# EAGLE design CPLD_Adapter (EAGLE 9.3.1)
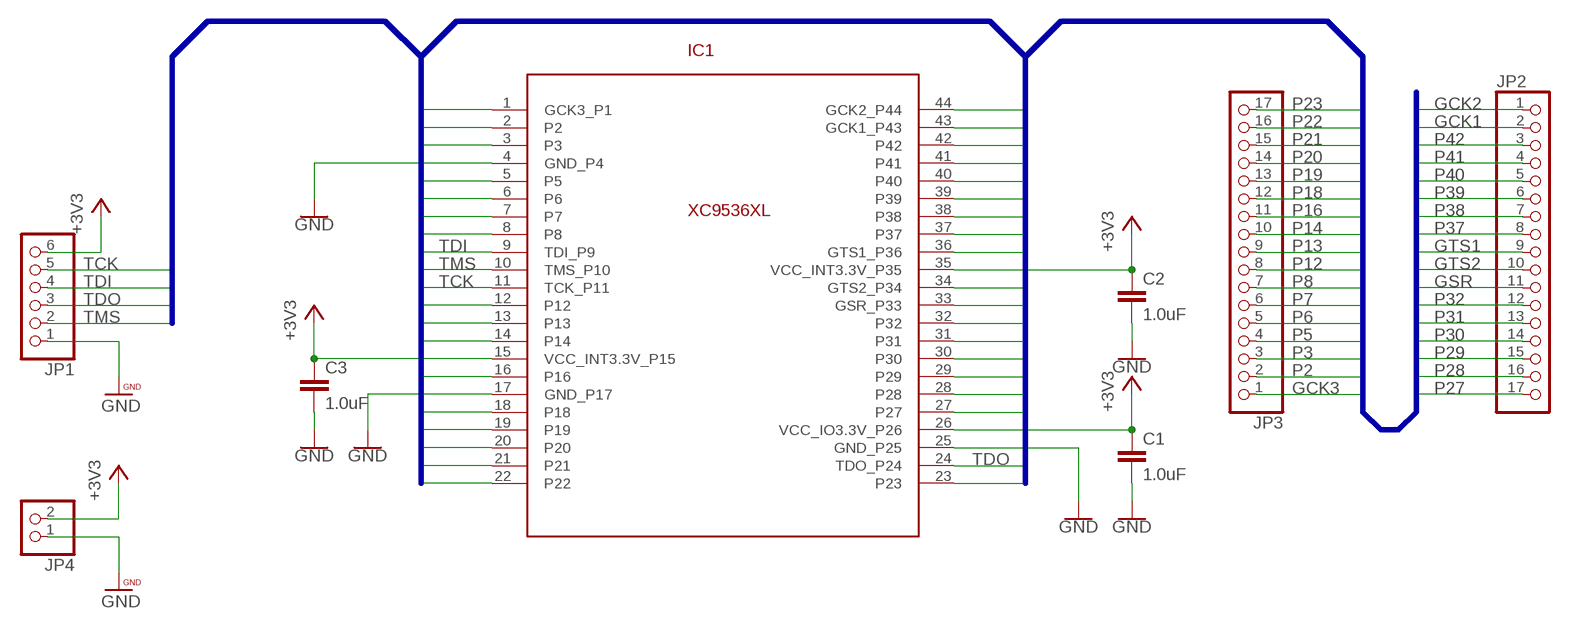
[diagram p0: schematic, sheet 1]

## Parts
C1  1.0uF  1.0UF-0603-16V-10%  [0603]
C2  1.0uF  1.0UF-0603-16V-10%  [0603]
C3  1.0uF  1.0UF-0603-16V-10%  [0603]
IC1  XC9536XL  [QFP80P1200X1200X105-44]
JP1  PINHD-1X6  [1X06]
JP2  PINHD-1X17  [1X17]
JP3  PINHD-1X17  [1X17]
JP4  PINHD-1X2  [1X02]

## Nets
+3V3: C1.1 C2.1 C3.1 IC1.15(VCC_INT3.3V_P15) IC1.26(VCC_IO3.3V_P26) IC1.35(VCC_INT3.3V_P35) JP1.6 JP4.2
GCK1: IC1.43(GCK1_P43) JP2.2
GCK2: IC1.44(GCK2_P44) JP2.1
GCK3: IC1.1(GCK3_P1) JP3.1
GND: C1.2 C2.2 C3.2 IC1.4(GND_P4) IC1.17(GND_P17) IC1.25(GND_P25) JP1.1 JP4.1
GSR: IC1.33(GSR_P33) JP2.11
GTS1: IC1.36(GTS1_P36) JP2.9
GTS2: IC1.34(GTS2_P34) JP2.10
P2: IC1.2 JP3.2
P3: IC1.3 JP3.3
P5: IC1.5 JP3.4
P6: IC1.6 JP3.5
P7: IC1.7 JP3.6
P8: IC1.8 JP3.7
P12: IC1.12 JP3.8
P13: IC1.13 JP3.9
P14: IC1.14 JP3.10
P16: IC1.16 JP3.11
P18: IC1.18 JP3.12
P19: IC1.19 JP3.13
P20: IC1.20 JP3.14
P21: IC1.21 JP3.15
P22: IC1.22 JP3.16
P23: IC1.23 JP3.17
P27: IC1.27 JP2.17
P28: IC1.28 JP2.16
P29: IC1.29 JP2.15
P30: IC1.30 JP2.14
P31: IC1.31 JP2.13
P32: IC1.32 JP2.12
P37: IC1.37 JP2.8
P38: IC1.38 JP2.7
P39: IC1.39 JP2.6
P40: IC1.40 JP2.5
P41: IC1.41 JP2.4
P42: IC1.42 JP2.3
TCK: IC1.11(TCK_P11) JP1.5
TDI: IC1.9(TDI_P9) JP1.4
TDO: IC1.24(TDO_P24) JP1.3
TMS: IC1.10(TMS_P10) JP1.2

## Buses
GCK[1..3],GSR,GTS[1..2],P[1..44],TCK,TDI,TDO,TMS

## Library data of the parts
C1-C3 = SparkFun-Capacitors:1.0UF: 1µF ceramic capacitors A capacitor is a passive two-terminal electrical component used to store electrical energy temporarily in an electric field.; PROD_ID: CAP-00868
IC1 = XL9536XL:XC9536XL
JP1 = pinhead:PINHD-1X6: PIN HEADER
JP2 JP3 = pinhead:PINHD-1X17: PIN HEADER
JP4 = pinhead:PINHD-1X2: PIN HEADER

## Board
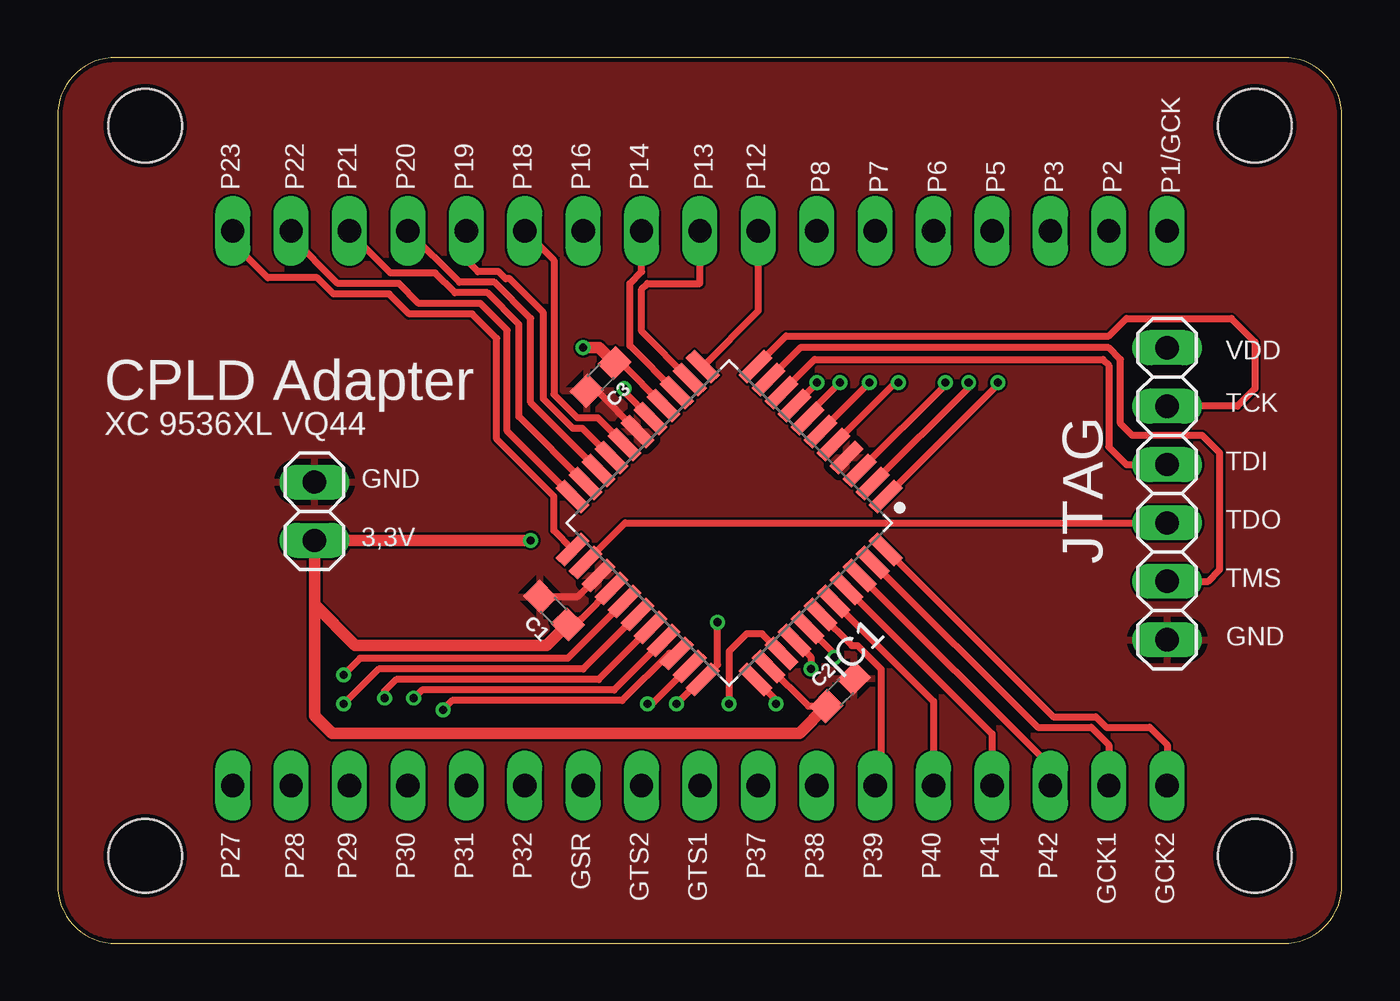
[diagram p1: board, top side]
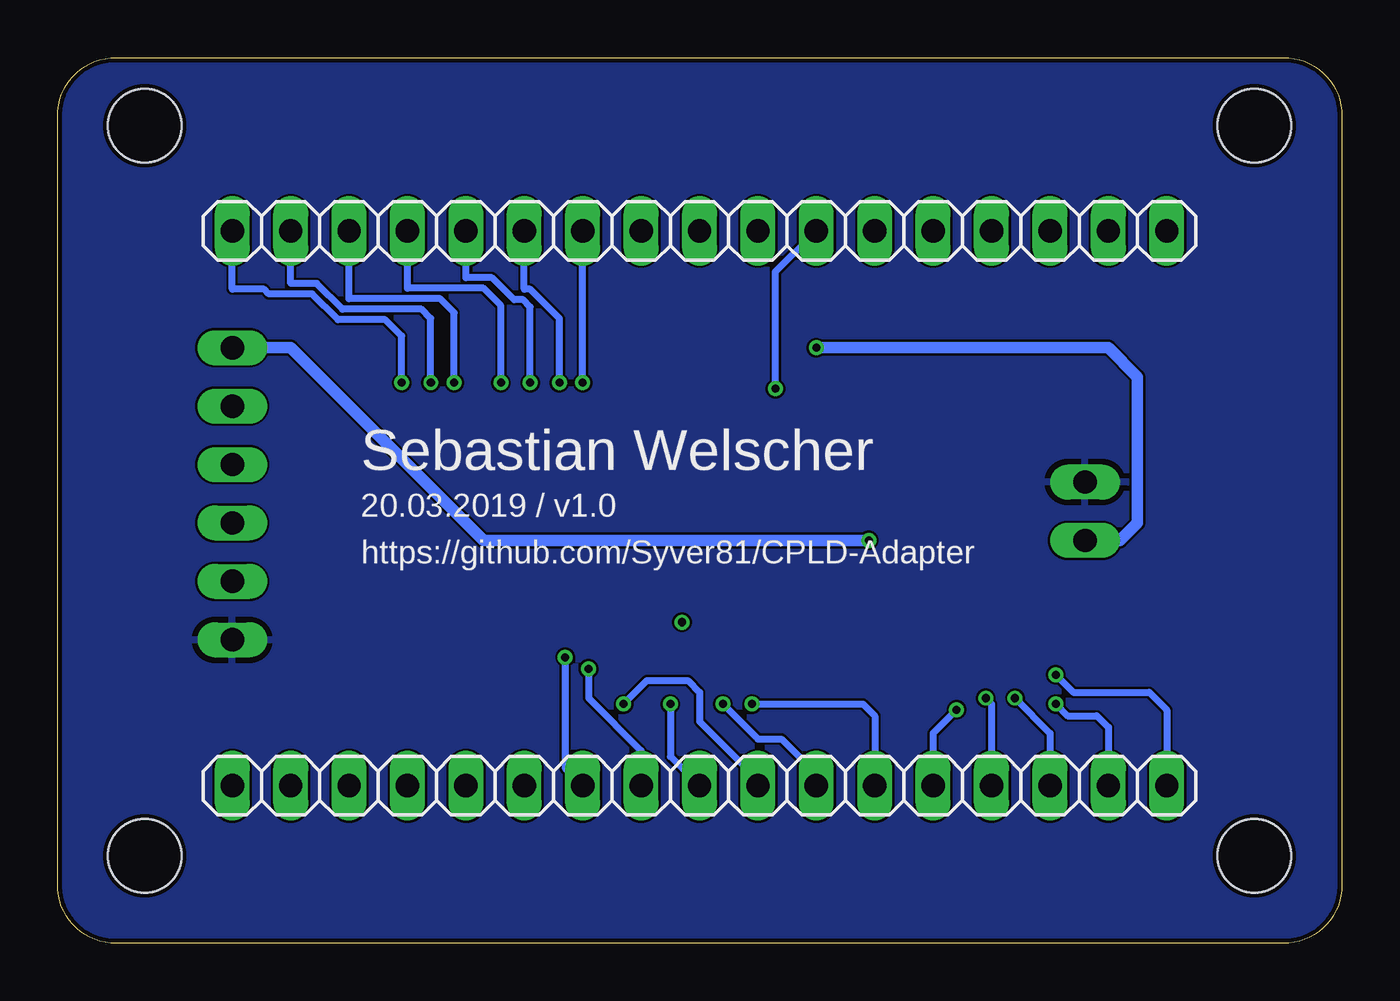
[diagram p2: board, bottom side, seen from below]

Size 55.86 x 38.53 mm. Coordinates in mm from the lower left corner, seen from the top.
Outline: 0,35.99 0,2.54 arc90 2.54,0 53.32,0 arc90 55.86,2.54 55.86,35.99 arc90 53.32,38.53 2.54,38.53 arc90 0,35.99
Copper layers (1*16): Top 0.035mm / dielectric 1.5mm / Bottom 0.035mm
Design rules "aisler_2_layer": minimum track width 0.1mm, minimum drill 0.2mm, track to track 0.1mm, track to pad 0.1mm, pad to pad 0.1mm, via to via 0.1mm, smd to smd 0.1mm, copper to edge 0.2mm, drill to drill 0.21mm, minimum pad ring 0.25mm, minimum via ring 0.15mm, stop-mask expansion 0mil, vias tented up to drill 0mil, thermal gap 10mil
Holes 3.2 mm at 3.81,3.81 3.81,35.56 52.07,3.81 52.07,35.56

### Footprints (pad centres in the part's own frame; a part is rotated, then mirrored left to right if it is on the bottom)
0603 = smd 1.1 x 1: 1 -0.85,0; 2 0.85,0
QFP80P1200X1200X105-44 = smd 1.562 x 0.531: 1 -5.625,4; 2 -5.625,3.2; 3 -5.625,2.4; 4 -5.625,1.6; 5 -5.625,0.8; 6 -5.625,0; 7 -5.625,-0.8; 8 -5.625,-1.6; 9 -5.625,-2.4; 10 -5.625,-3.2; 11 -5.625,-4; 23 5.625,-4; 24 5.625,-3.2; 25 5.625,-2.4; 26 5.625,-1.6; 27 5.625,-0.8; 28 5.625,0; 29 5.625,0.8; 30 5.625,1.6; 31 5.625,2.4; 32 5.625,3.2; 33 5.625,4 | smd 0.531 x 1.562: 12 -4,-5.625; 13 -3.2,-5.625; 14 -2.4,-5.625; 15 -1.6,-5.625; 16 -0.8,-5.625; 17 0,-5.625; 18 0.8,-5.625; 19 1.6,-5.625; 20 2.4,-5.625; 21 3.2,-5.625; 22 4,-5.625; 34 4,5.625; 35 3.2,5.625; 36 2.4,5.625; 37 1.6,5.625; 38 0.8,5.625; 39 0,5.625; 40 -0.8,5.625; 41 -1.6,5.625; 42 -2.4,5.625; 43 -3.2,5.625; 44 -4,5.625
1X06 = drill 1.016 long: 1 -6.35,0; 2 -3.81,0; 3 -1.27,0; 4 1.27,0; 5 3.81,0; 6 6.35,0
1X17 = drill 1.016 long: 1 -20.32,0; 2 -17.78,0; 3 -15.24,0; 4 -12.7,0; 5 -10.16,0; 6 -7.62,0; 7 -5.08,0; 8 -2.54,0; 9 0,0; 10 2.54,0; 11 5.08,0; 12 7.62,0; 13 10.16,0; 14 12.7,0; 15 15.24,0; 16 17.78,0; 17 20.32,0
1X02 = drill 1.016 long: 1 -1.27,0; 2 1.27,0

### Placement (x,y rotation side)
C1  21.59,14.48 135 top
C2  34.04,10.92 45 top
C3  23.62,24.64 225 top
IC1  29.21,18.29 225 top
JP1  48.26,19.56 90 top
JP2  27.94,6.86 0 bottom
JP3  27.94,30.99 0 bottom
JP4  11.18,18.8 270 top

### Tracks (layer width: path | path; a pad name or v marks a point on that pad's centre or on a via)
+3V3  (via drill 0.35)
  Top 0.305: IC1.35 32.65,10.32 C2.1 | IC1.15 24.52,25.24 C3.1 | IC1.26 22.78,14.12 arc-45 C1.1
  Top 0.508: C3.1 23.55,25.91 v22.86,25.91 | 11.18,14.73 12.95,12.95 21.27,12.95 C1.1 | 11.18,14.73 JP4.2 v20.57,17.53 | C2.1 32.26,9.14 11.94,9.14 11.18,9.91 11.18,14.73
  Bottom 0.508: v22.86,25.91 10.16,25.91 8.89,24.64 8.89,18.29 9.65,17.53 JP4.2 | v20.57,17.53 37.34,17.53 45.72,25.91 JP1.6
GCK1
  Top 0.305: IC1.43 42.62,9.4 44.96,9.4 45.72,8.64 JP2.2
GCK2
  Top 0.305: IC1.44 43.3,9.86 45.15,9.86 45.61,9.4 47.5,9.4 48.26,8.64 JP2.1
GCK3  (via drill 0.35)
  Top 0.305: IC1.1 40.89,24.31 v40.89,24.38
  Bottom 0.305: v40.89,24.38 40.89,26.42 41.61,27.13 43.66,27.13 44.78,28.24 46.67,28.24 46.88,28.45 48.26,28.45 JP3.1
GND
  Top 0.305: IC1.25 22.61,15.08 C1.2 | IC1.17 23.46,24.04 C3.2
  pour Top: -1.27,39.37 57.15,39.37 57.15,-1.27 -1.27,-1.27
  pour Bottom: -1.27,39.37 57.15,39.37 57.15,-1.27 -1.27,-1.27
GSR  (via drill 0.35)
  Top 0.305: v28.7,13.97 28.7,12.12 IC1.33 27.99,11.48 v26.92,10.41
  Bottom 0.305: v26.92,10.41 25.4,8.89 24.38,8.89 22.86,7.37 JP2.11
GTS1  (via drill 0.35)
  Top 0.305: IC1.36 30.64,13.46 29.97,13.46 29.21,12.7 v29.21,10.41
  Bottom 0.305: v29.21,10.41 29.21,8.13 JP2.9
GTS2  (via drill 0.35)
  Top 0.305: IC1.34 31.24,10.6 v31.24,10.41
  Bottom 0.305: v31.24,10.41 30.23,11.43 28.45,11.43 27.94,10.92 27.94,9.65 25.4,7.11 JP2.10
P2  (via drill 0.35)
  Top 0.305: IC1.2 39.62,24.18 v39.62,24.38
  Bottom 0.305: v39.62,24.38 39.62,27.18 40.03,27.58 43.47,27.58 44.59,28.7 45.72,28.7 JP3.2
P3  (via drill 0.35)
  Top 0.305: IC1.3 38.61,24.29 v38.61,24.38
  Bottom 0.305: v38.61,24.38 38.61,27.43 39.22,28.04 43.18,28.04 JP3.3
P5  (via drill 0.35)
  Top 0.305: IC1.5 36.44,24.38 v36.58,24.38
  Bottom 0.305: v36.58,24.38 36.58,27.74 37.34,28.5 40.64,28.5 JP3.4
P6  (via drill 0.35)
  Top 0.305: IC1.6 v35.31,24.38
  Bottom 0.305: v35.31,24.38 35.31,27.69 35.61,27.99 36,27.99 36.97,28.96 38.1,28.96 JP3.5
P7  (via drill 0.35)
  Top 0.305: IC1.7 32.62,22.97 v34.04,24.38
  Bottom 0.305: v34.04,24.38 34.04,27.18 35.31,28.45 35.56,28.45 JP3.6
P8  (via drill 0.35)
  Top 0.305: IC1.8 33.02,24.36 v33.02,24.38
  Bottom 0.305: v33.02,24.38 JP3.7
P12
  Top 0.305: IC1.12 30.48,27.51 JP3.8
P13
  Top 0.305: IC1.13 25.4,26.62 25.4,28.45 25.65,28.7 27.94,28.7 JP3.9
P14
  Top 0.305: IC1.14 24.89,26 24.89,28.7 25.4,29.21 JP3.10
P16  (via drill 0.35)
  Top 0.305: IC1.16 24.64,23.99 v24.64,24.13
  Bottom 0.305: JP3.11 24.64,29.21 v24.64,24.13
P18
  Top 0.305: IC1.18 23.51,22.86 22.61,22.86 21.59,23.88 21.59,29.72 JP3.12
P19
  Top 0.305: IC1.19 22.83,22.4 22.42,22.4 21.13,23.69 21.13,27.43 19.66,28.9 19.49,28.9 19.19,29.21 18.29,29.21 17.78,29.72 JP3.13
P20
  Top 0.305: IC1.20 20.57,23.53 20.57,27.18 19,28.75 17.47,28.75 JP3.14
P21
  Top 0.305: IC1.21 20.07,22.91 20.07,26.92 18.69,28.3 17.29,28.3 16.42,29.16 14.48,29.16 12.7,30.94 JP3.15
P22
  Top 0.305: IC1.22 19.56,22.28 19.56,26.67 18.39,27.84 15.71,27.84 14.85,28.7 12.19,28.7 10.16,30.73 JP3.16
P23
  Top 0.305: IC1.23 21.59,17.95 21.59,19.44 19.1,21.93 19.1,26.31 18.03,27.38 15.29,27.38 14.43,28.24 12,28.24 11.29,28.96 9.14,28.96 7.62,30.48 JP3.17
P27  (via drill 0.35)
  Top 0.305: IC1.27 22.19,12.39 13.16,12.39 v12.45,11.68
  Bottom 0.305: v12.45,11.68 11.68,10.92 8.38,10.92 7.62,10.16 JP2.17
P28  (via drill 0.35)
  Top 0.305: IC1.28 22.86,11.94 13.97,11.94 v12.45,10.41
  Bottom 0.305: v12.45,10.41 11.94,9.91 10.67,9.91 10.16,9.4 JP2.16
P29  (via drill 0.35)
  Top 0.305: IC1.29 23.53,11.48 14.73,11.48 14.22,10.97 v14.22,10.67
  Bottom 0.305: JP2.15 12.7,9.14 v14.22,10.67
P30  (via drill 0.35)
  Top 0.305: IC1.30 24.21,11.02 15.85,11.02 v15.49,10.67
  Bottom 0.305: v15.49,10.67 15.24,10.41 JP2.14
P31  (via drill 0.35)
  Top 0.305: IC1.31 26.61,12.61 24.56,10.57 17.17,10.57 v16.76,10.16
  Bottom 0.305: v16.76,10.16 17.78,9.14 JP2.13
P32  (via drill 0.35)
  Top 0.305: IC1.32 25.86,10.41 v25.65,10.41
  Bottom 0.305: v25.65,10.41 20.83,10.41 20.32,9.91 JP2.12
P37  (via drill 0.35)
  Top 0.305: IC1.37 32.77,12.47 v32.77,11.94
  Bottom 0.305: v32.77,11.94 32.77,10.67 30.48,8.38 JP2.8
P38  (via drill 0.35)
  Top 0.305: IC1.38 33.78,12.59 v33.78,12.45
  Bottom 0.305: v33.78,12.45 33.78,7.62 JP2.7
P39
  Top 0.305: IC1.39 34.54,12.95 34.8,12.95 35.81,11.94 35.81,7.11 JP2.6
P40
  Top 0.305: IC1.40 38.1,10.53 JP2.5
P41
  Top 0.305: IC1.41 40.64,9.12 JP2.4
P42
  Top 0.305: IC1.42 43.18,7.71 JP2.3
TCK
  Top 0.305: IC1.11 31.68,26.42 45.72,26.42 46.48,27.18 51.05,27.18 52.07,26.16 52.07,24.13 51.31,23.37 JP1.5
TDI
  Top 0.305: IC1.9 32.93,25.4 45.47,25.4 45.72,25.15 45.72,21.59 46.48,20.83 JP1.4
TDO
  Top 0.305: IC1.24 24.68,18.29 JP1.3
TMS
  Top 0.305: IC1.10 32.3,25.91 45.72,25.91 46.23,25.4 46.23,22.61 46.74,22.1 49.78,22.1 50.55,21.34 50.55,16.26 50.04,15.75 JP1.2

### Text on the board
tNames: P1/GCK | P23 | P22 | P21 | P20 | P19 | P18 | P16 | P14 | P13 | P12 | P8 | P7 | P6 | P5 | P3 | P2 | VDD | CPLD Adapter | TCK | XC 9536XL VQ44 | TDI | GND | 3,3V | TDO | JTAG | TMS | GND | P27 | P28 | P29 | P30 | P31 | P32 | GSR | GTS2 | GTS1 | P37 | P38 | P39 | P40 | P41 | P42 | GCK1 | GCK2
bNames: Sebastian Welscher | 20.03.2019 / v1.0 | https://github.com/Syver81/CPLD-Adapter